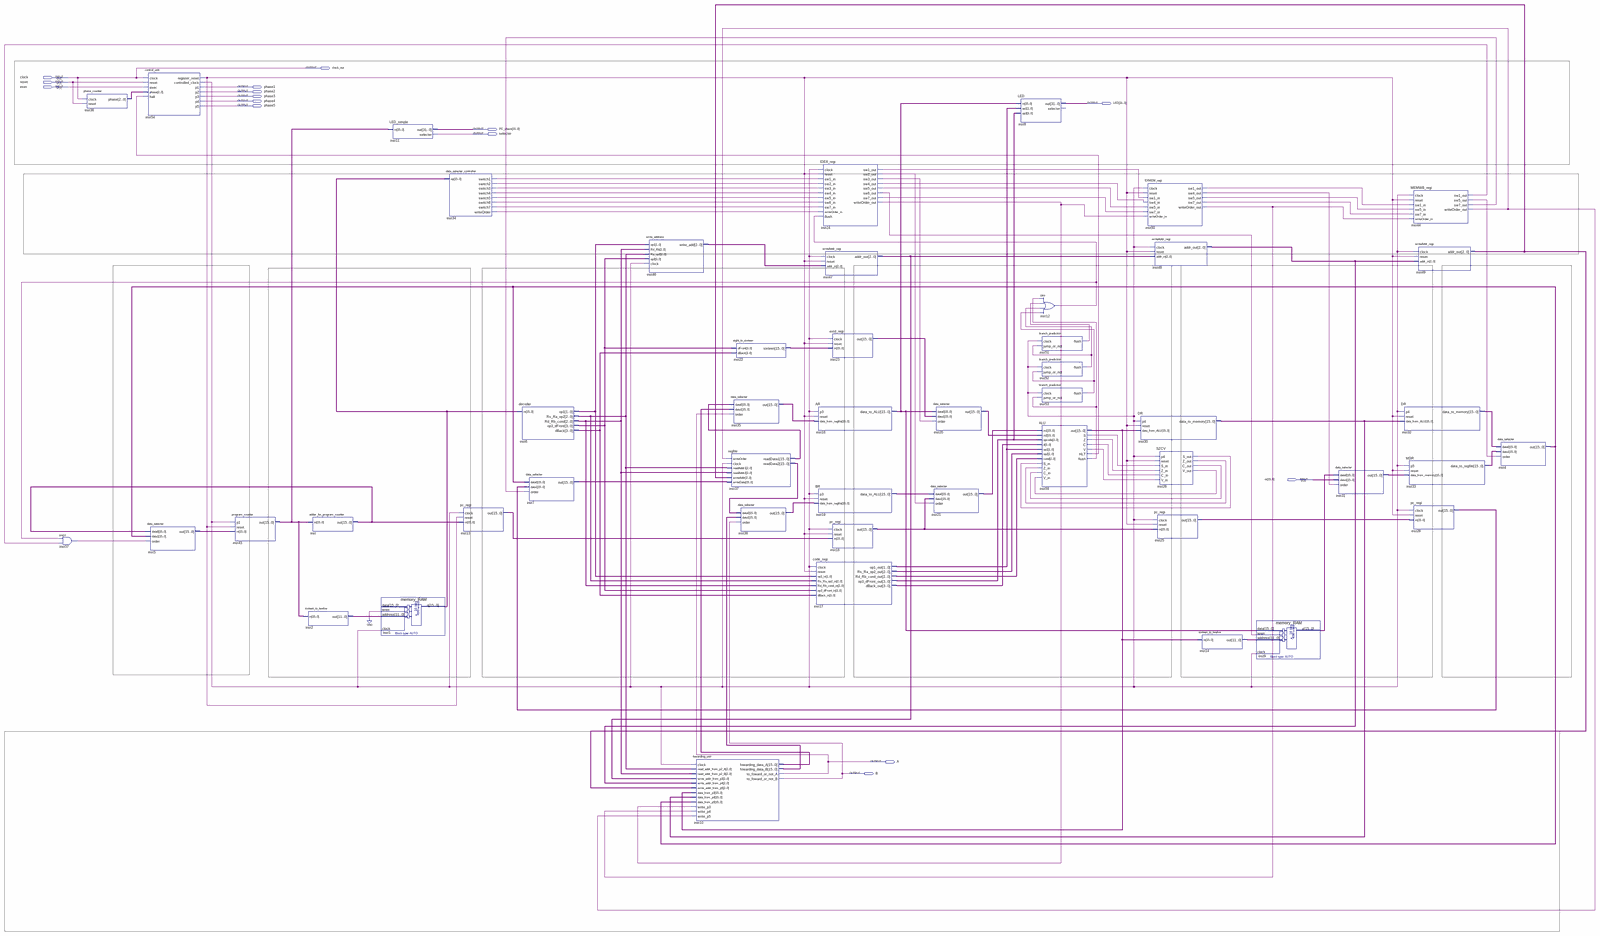
[diagram p0: schematic sheet, whole]
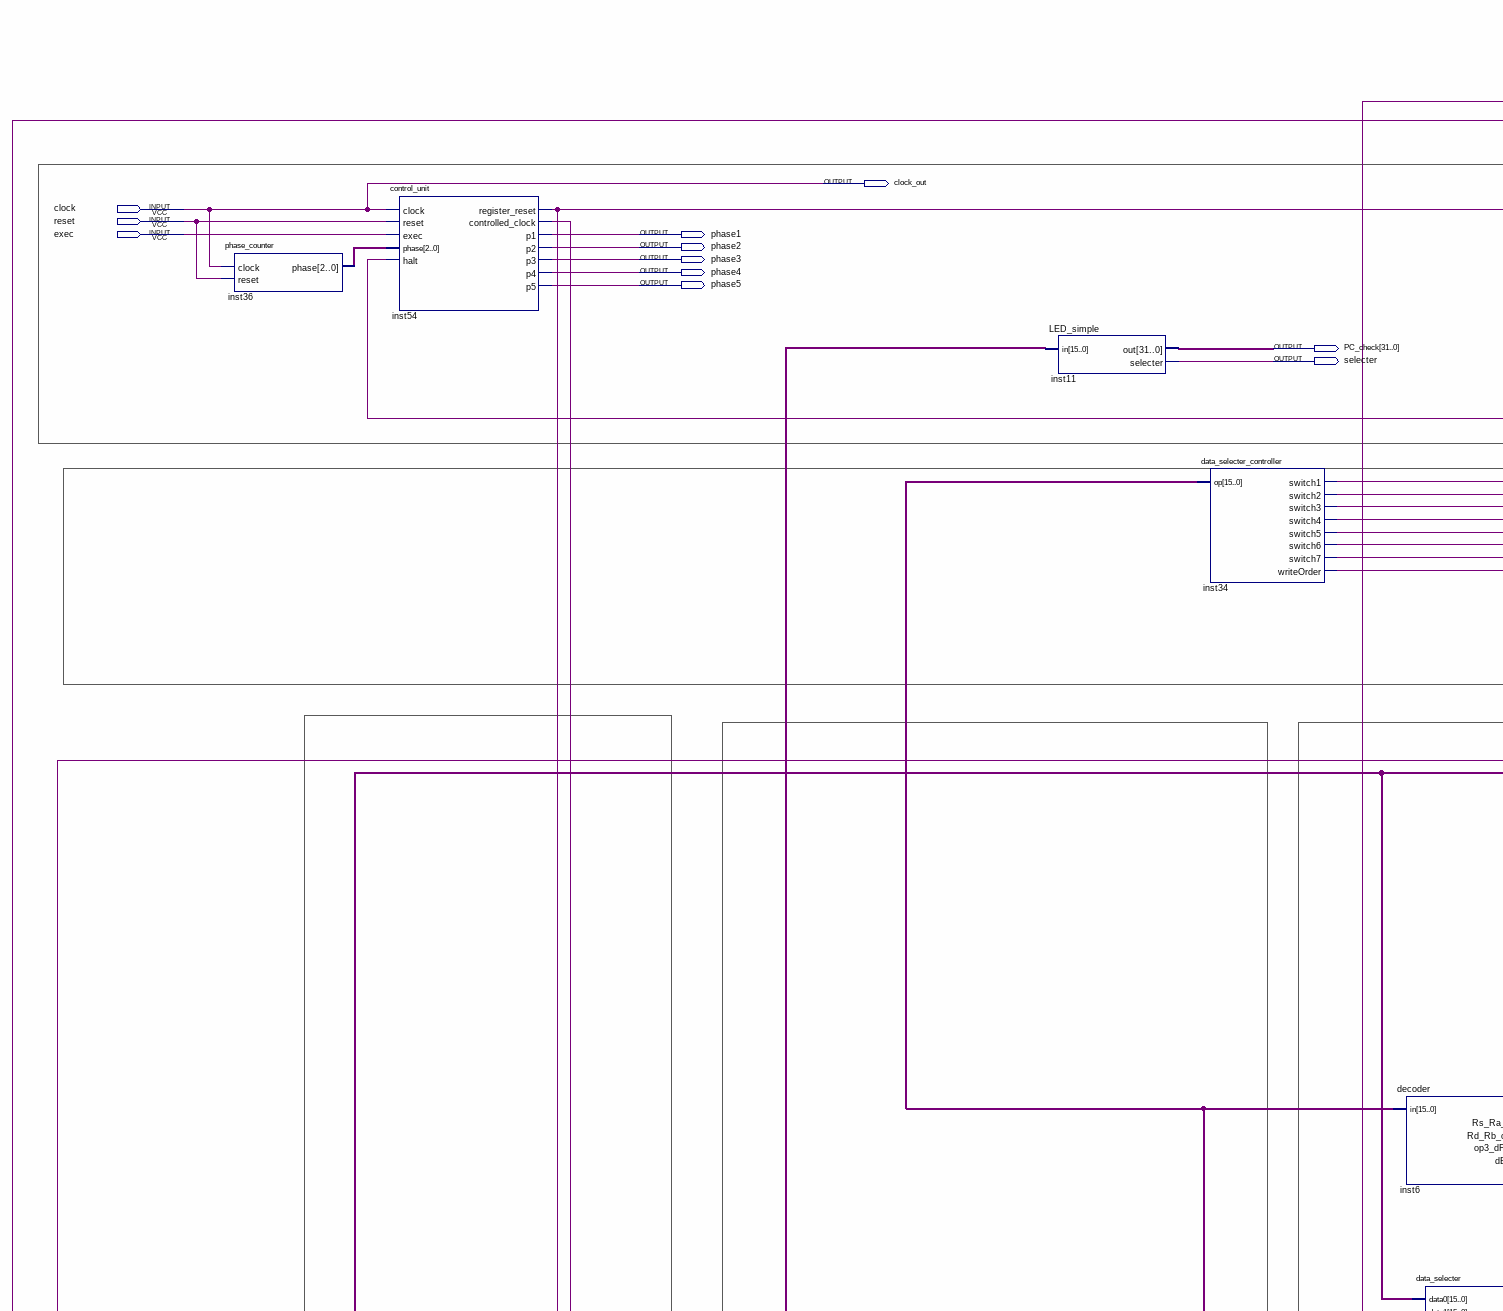
[diagram p1: schematic sheet, upper left part]
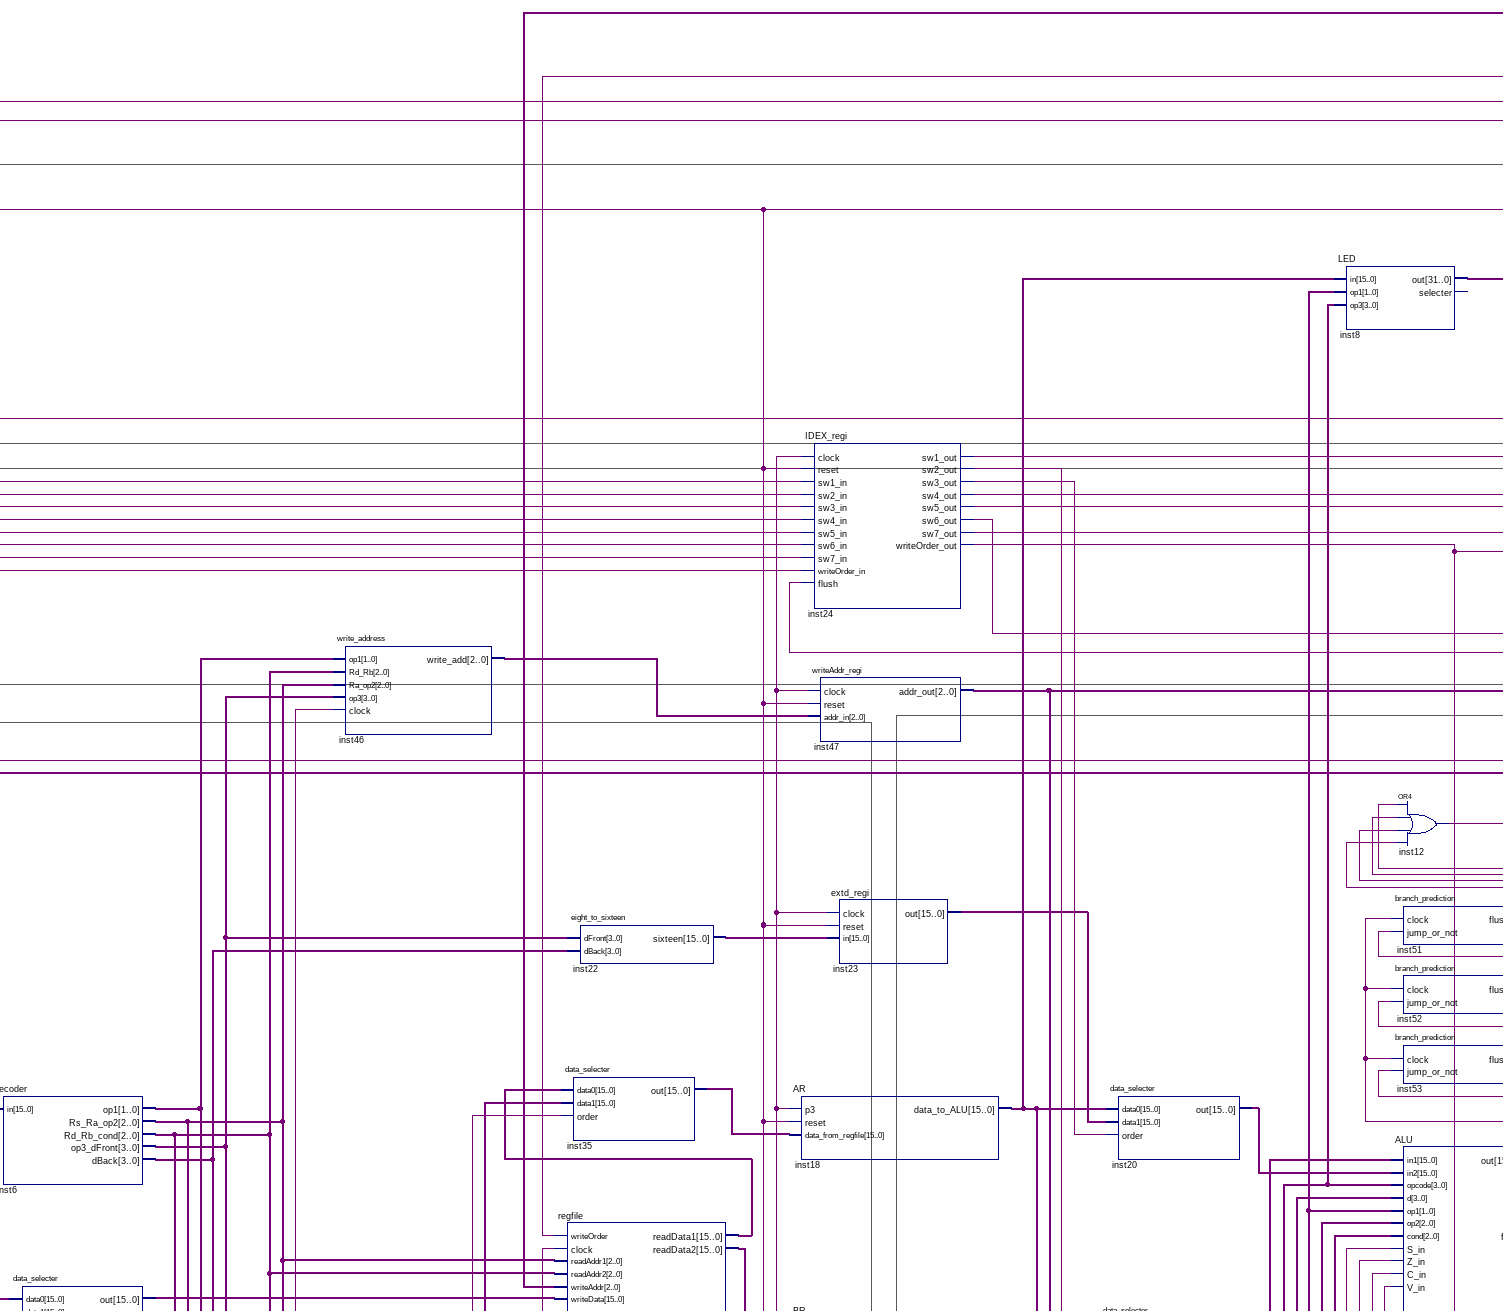
[diagram p2: schematic sheet, upper centre part]
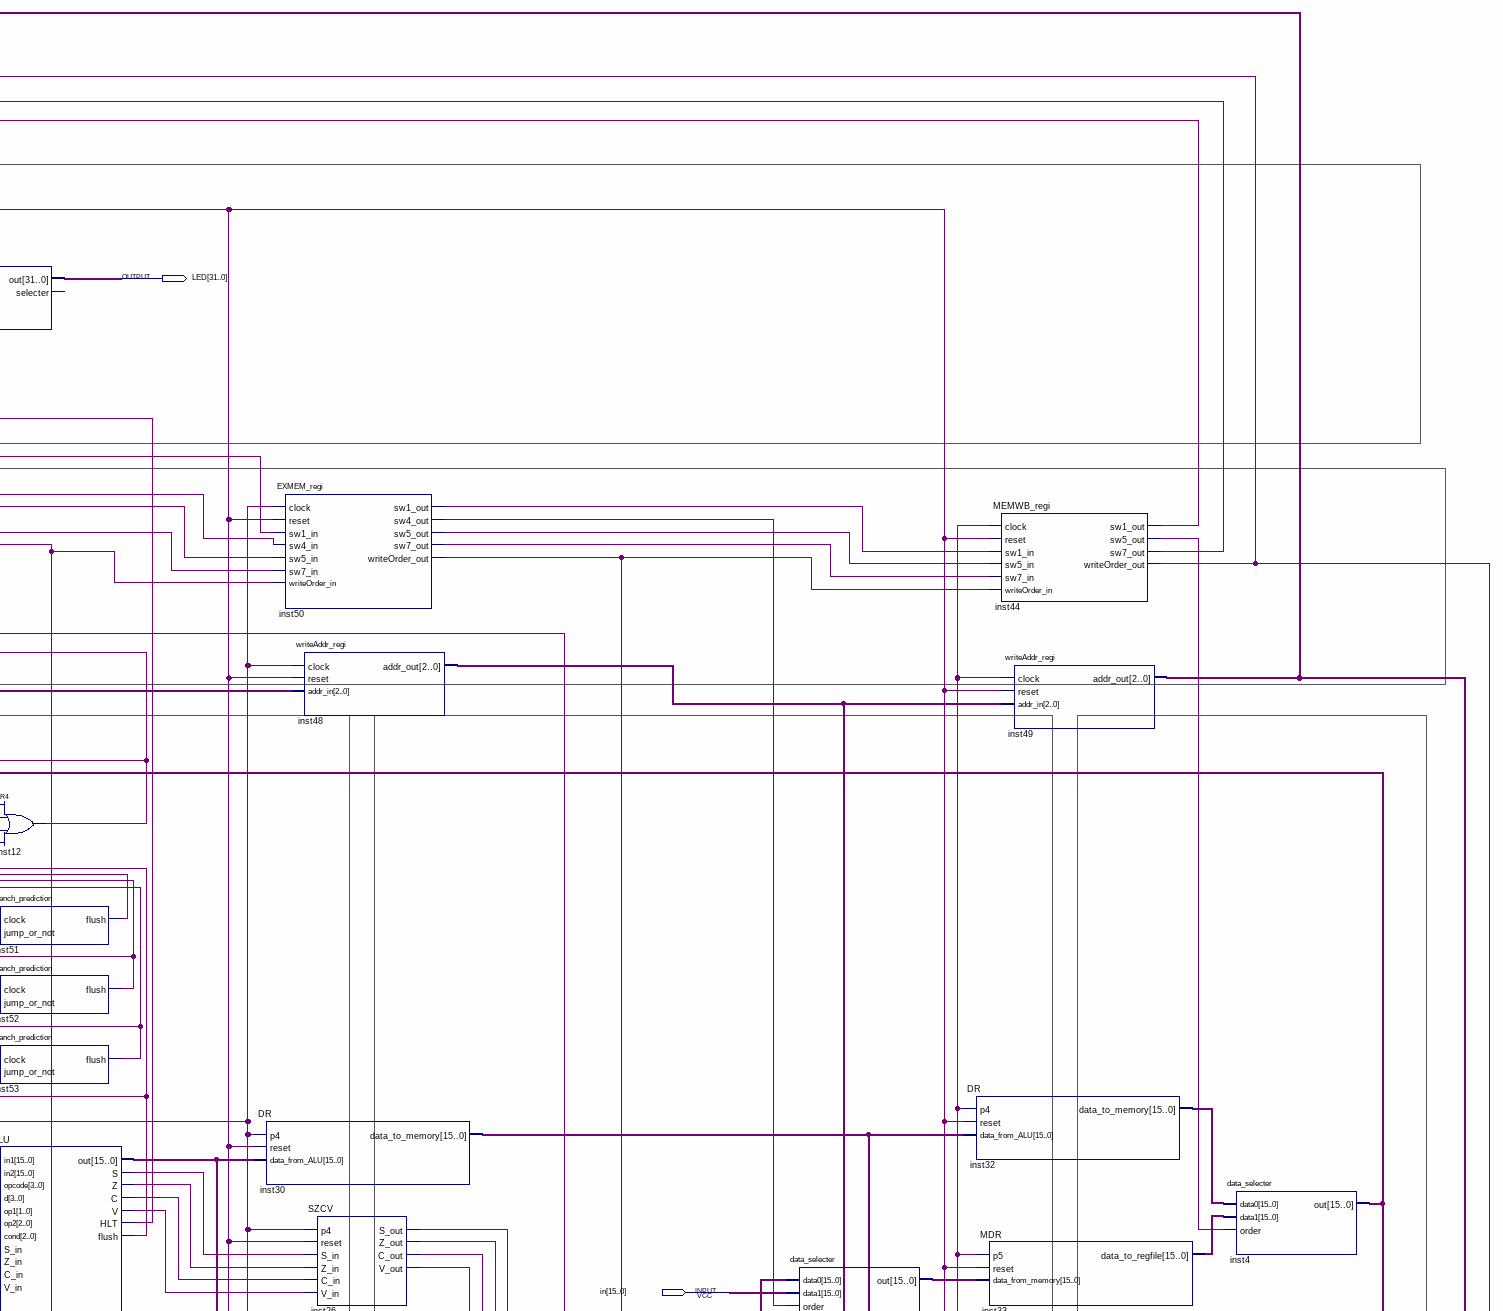
[diagram p3: schematic sheet, upper right part]
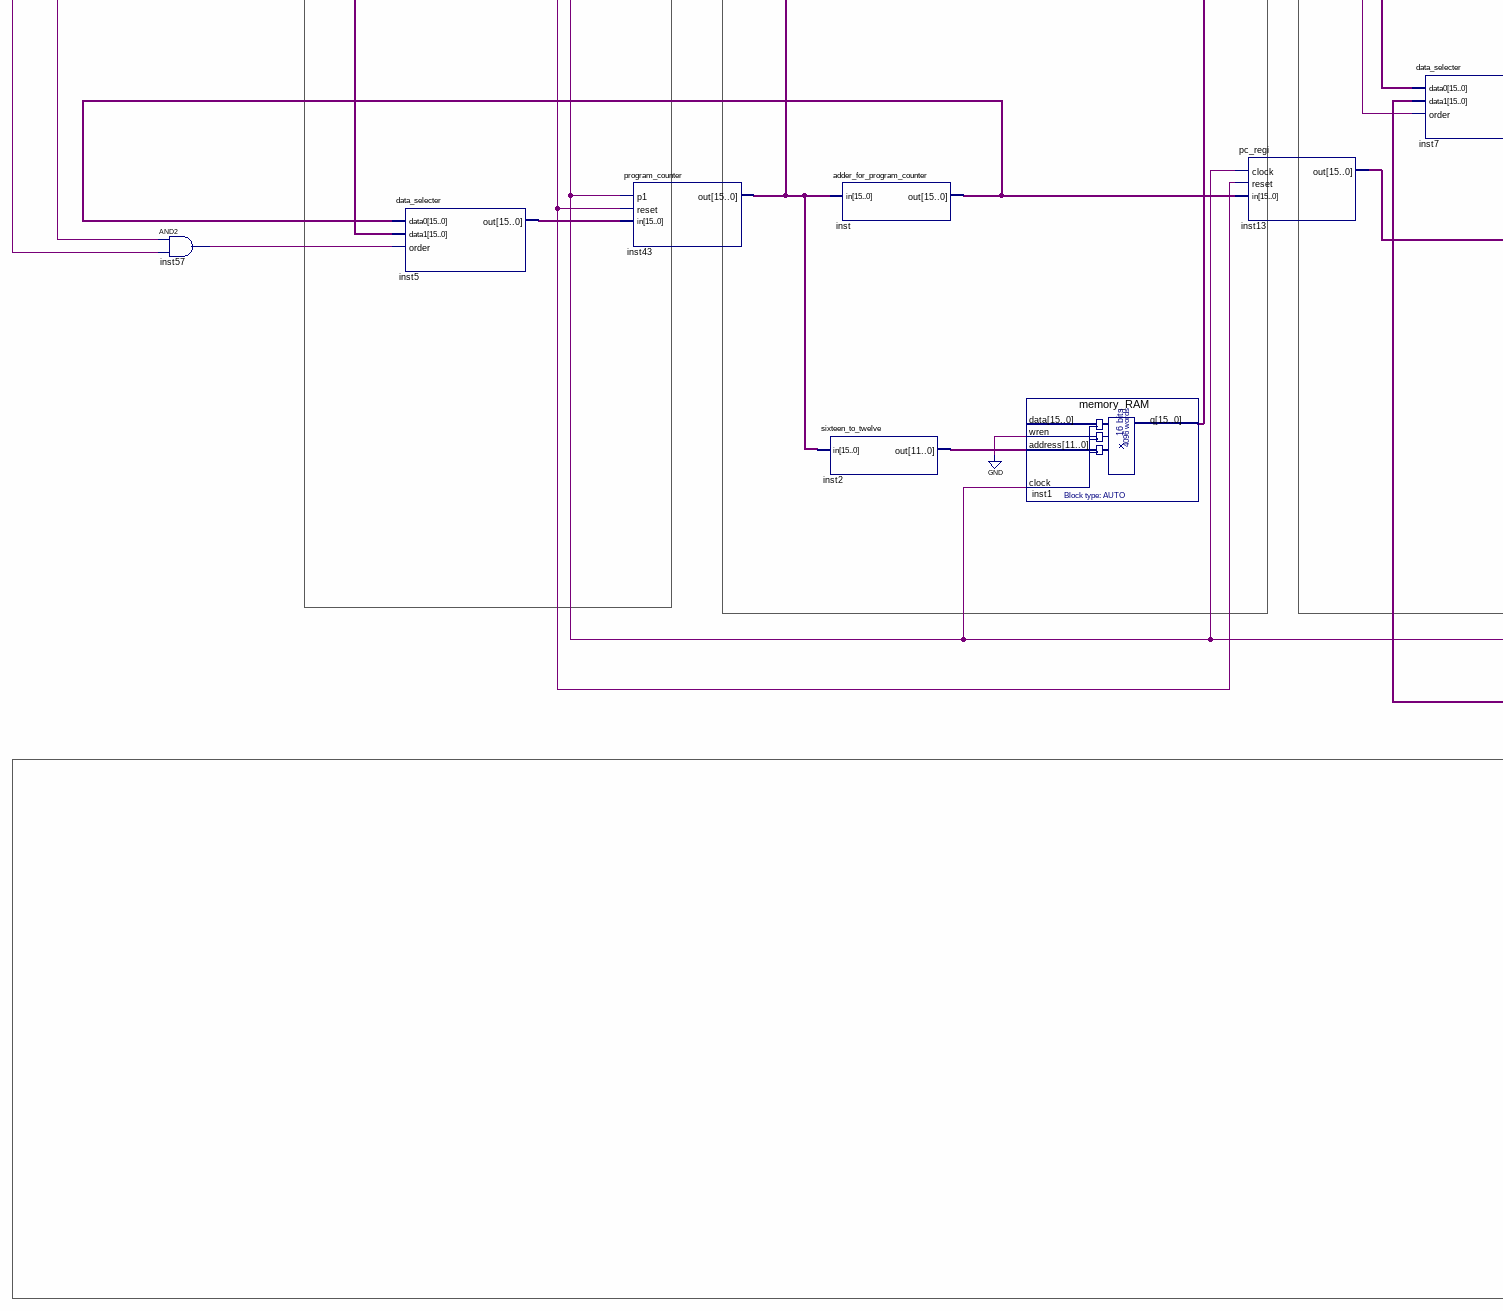
[diagram p4: schematic sheet, lower left part]
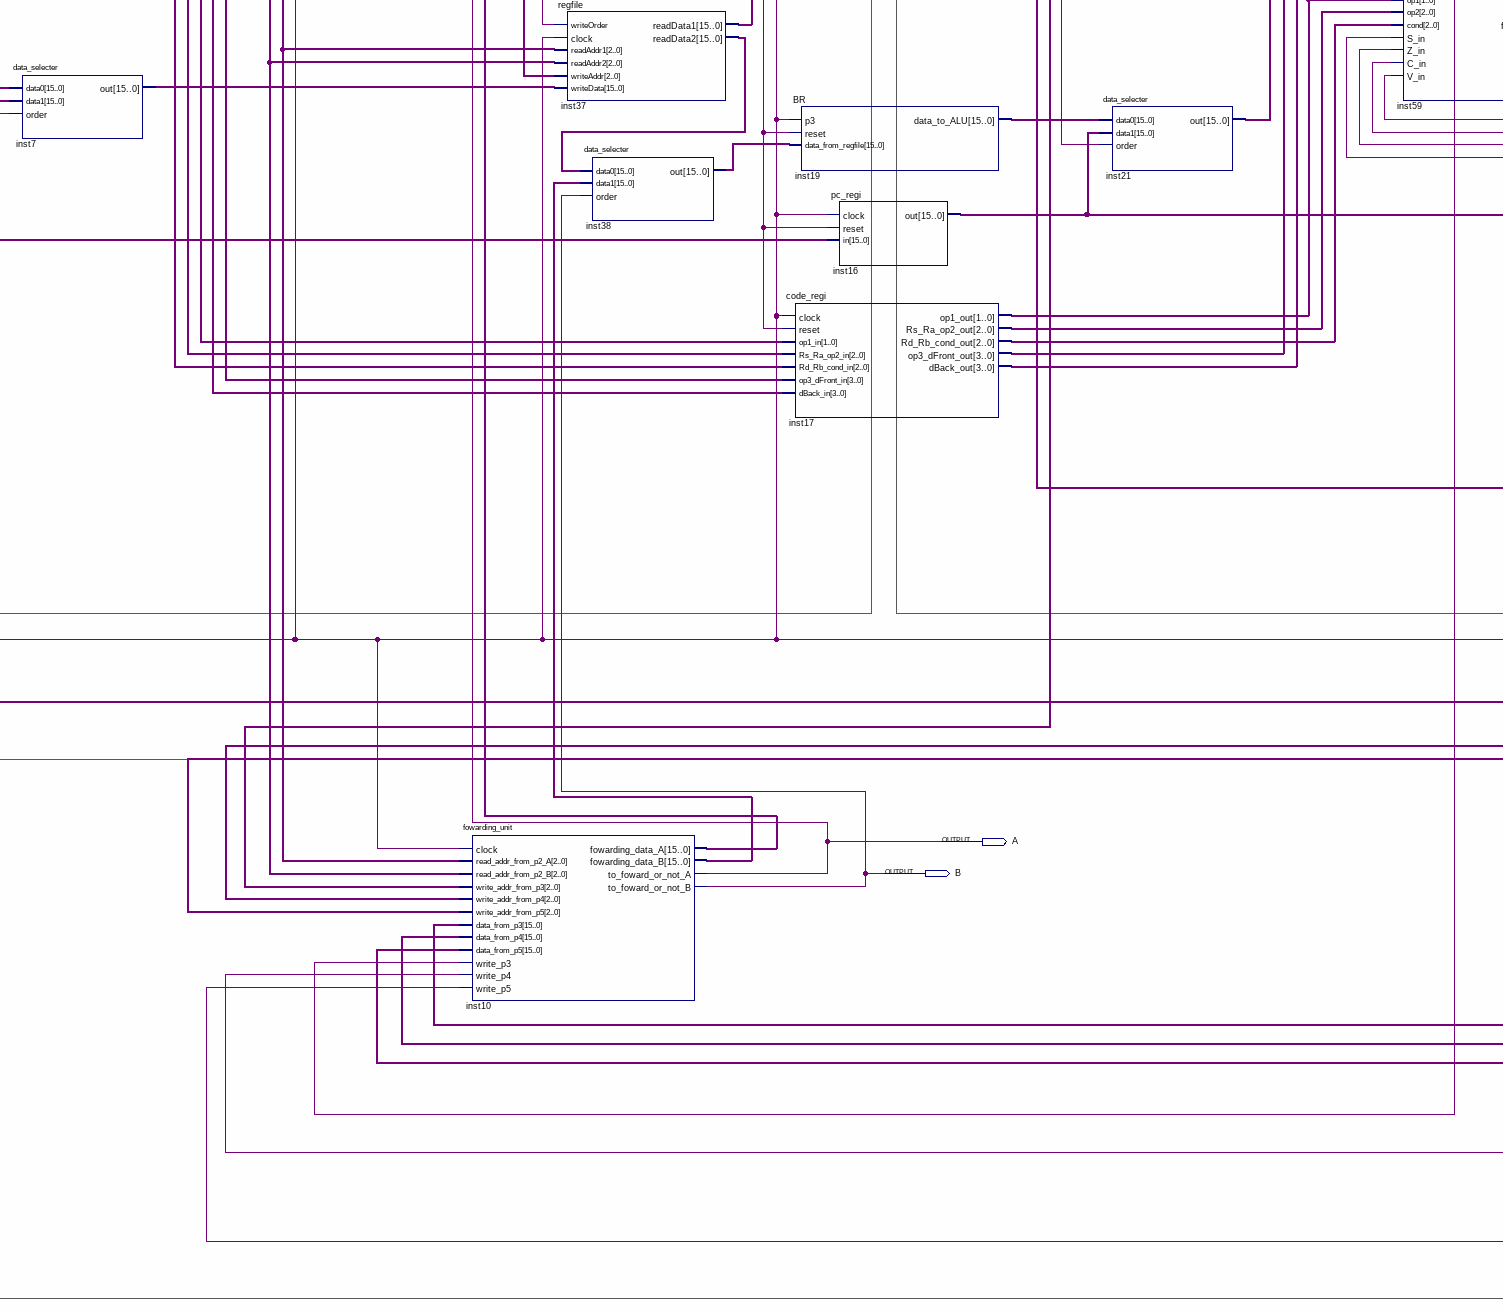
[diagram p5: schematic sheet, lower centre part]
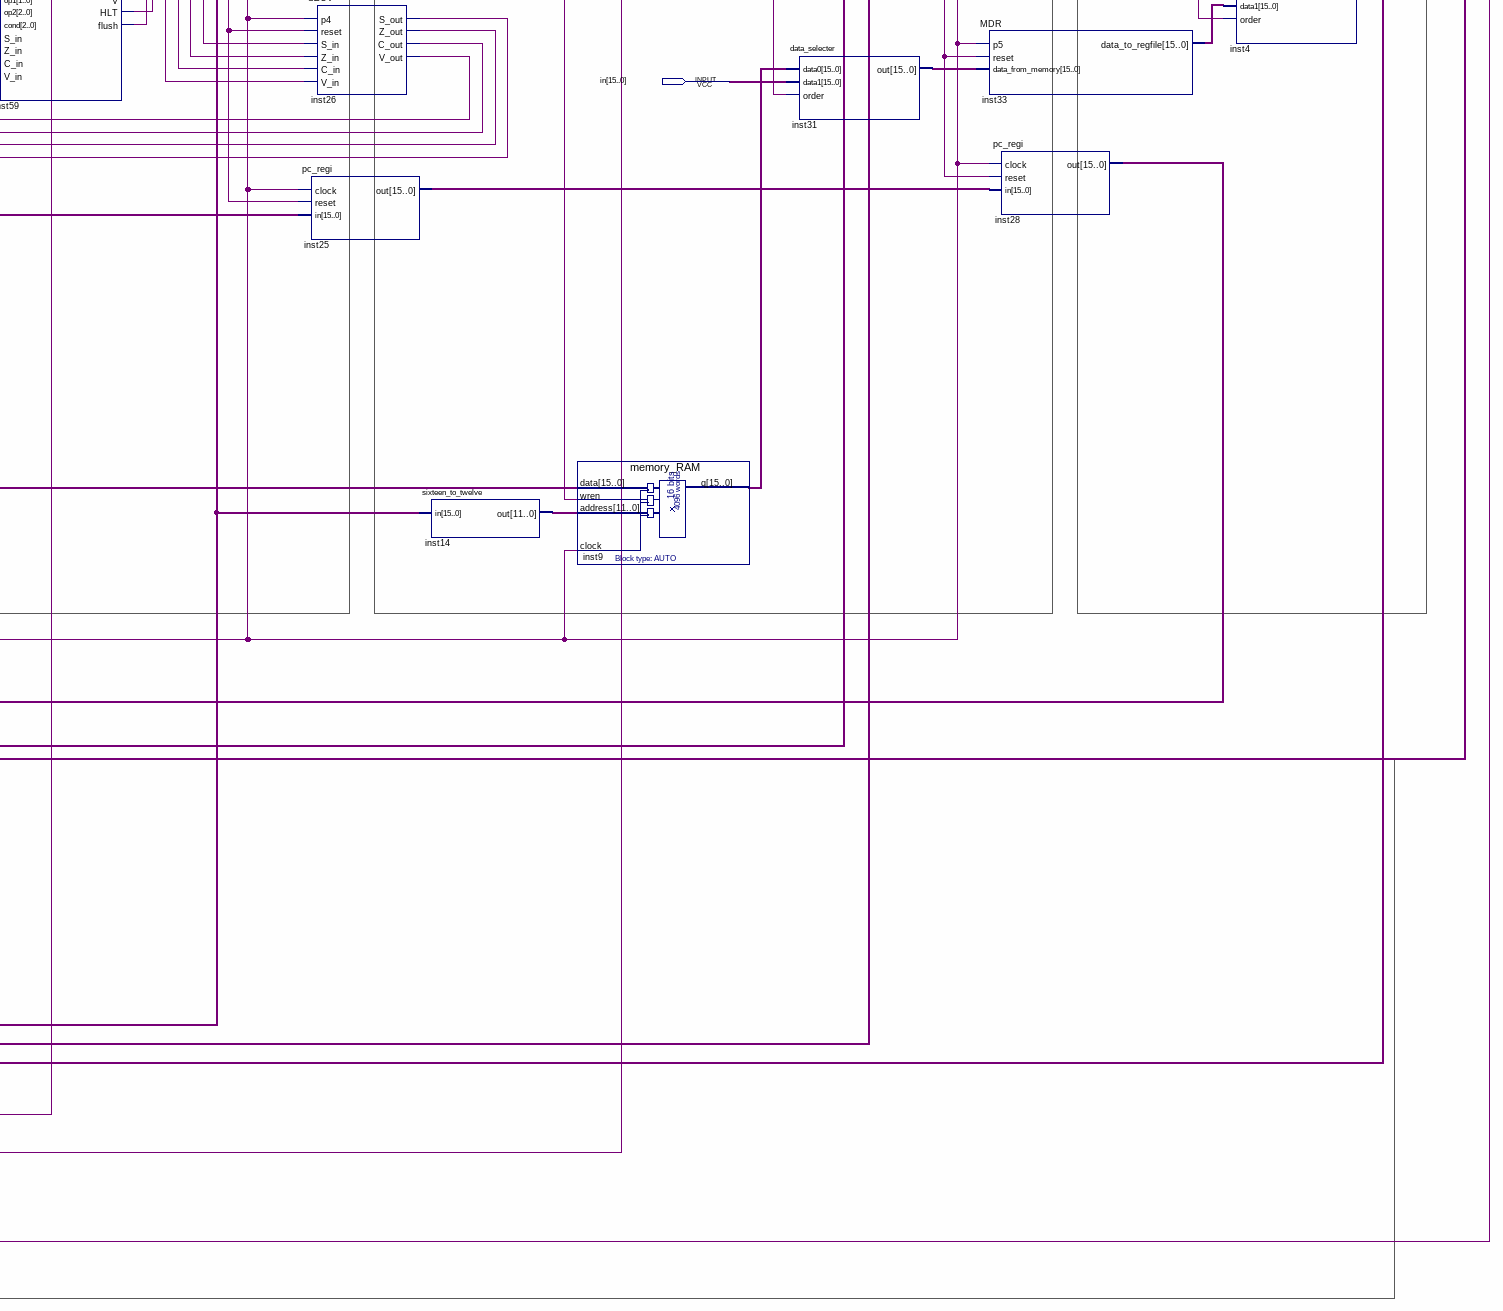
[diagram p6: schematic sheet, lower right part]
// Quartus schematic processor_HARAGUCHI.bdf as structural Verilog: 48 symbols, 15 pins
module processor_HARAGUCHI (
  input  clock,
  input  reset,
  input  exec,
  input  [15:0] in,
  output clock_out,
  output phase1,
  output phase2,
  output phase3,
  output phase4,
  output [31:0] LED,
  output phase5,
  output [31:0] PC_check,
  output selecter,
  output A,
  output B
);

  wire inst12_out, inst24_sw1_out, inst24_sw2_out, inst24_sw3_out, inst24_sw4_out, inst24_sw5_out,
       inst24_sw6_out, inst24_sw7_out, inst24_writeorder_out, inst26_c_out, inst26_s_out, inst26_v_out,
       inst26_z_out, inst34_switch1, inst34_switch2, inst34_switch3, inst34_switch4, inst34_switch5,
       inst34_switch6, inst34_switch7, inst34_writeorder, inst44_sw1_out, inst44_sw5_out, inst44_sw7_out,
       inst44_writeorder_out, inst50_sw1_out, inst50_sw4_out, inst50_sw5_out, inst50_sw7_out,
       inst50_writeorder_out, inst51_flush, inst52_flush, inst53_flush, inst54_controlled_clock,
       inst54_register_reset, inst57_out, inst59_c, inst59_flush, inst59_hlt, inst59_s, inst59_v, inst59_z;
  wire [1:0] inst6_op1, inst17_op1_out;
  wire [2:0] inst6_rd_rb_cond, inst6_rs_ra_op2, inst17_rd_rb_cond_out, inst17_rs_ra_op2_out, inst36_phase,
       inst46_write_add, inst47_addr_out, inst48_addr_out, inst49_addr_out;
  wire [3:0] inst6_dback, inst6_op3_dfront, inst17_dback_out, inst17_op3_dfront_out;
  wire [11:0] inst2_out, inst14_out;
  wire [15:0] inst1_q, inst4_out, inst5_out, inst7_out, inst9_q, inst10_fowarding_data_a,
       inst10_fowarding_data_b, inst13_out, inst16_out, inst18_data_to_alu, inst19_data_to_alu, inst20_out,
       inst21_out, inst22_sixteen, inst23_out, inst25_out, inst28_out, inst30_data_to_memory, inst31_out,
       inst32_data_to_memory, inst33_data_to_regfile, inst35_out, inst37_readdata1, inst37_readdata2,
       inst38_out, inst43_out, inst59_out, inst_out;

  and inst57 (inst57_out, inst12_out, inst44_sw1_out);
  phase_counter inst36 (.clock(clock), .reset(reset), .phase(inst36_phase));
  control_unit inst54 (
    .clock(clock), .reset(reset), .exec(exec), .phase(inst36_phase), .halt(inst59_hlt),
    .register_reset(inst54_register_reset), .controlled_clock(inst54_controlled_clock), .p1(phase1),
    .p2(phase2), .p3(phase3), .p4(phase4), .p5(phase5));
  data_selecter inst5 (.data0(inst_out), .data1(inst4_out), .order(inst57_out), .out(inst5_out));
  program_counter inst43 (
    .p1(inst54_controlled_clock), .reset(inst54_register_reset), .in(inst5_out), .out(inst43_out));
  sixteen_to_twelve inst2 (.in(inst43_out), .out(inst2_out));
  adder_for_program_counter inst (.in(inst43_out), .out(inst_out));
  LED_simple inst11 (.in(inst43_out), .out(PC_check), .selecter(selecter));
  memory_RAM inst1 (.wren(1'b0), .address(inst2_out), .clock(inst54_controlled_clock), .q(inst1_q));  // open: data
  data_selecter_controller inst34 (
    .op(inst1_q), .switch1(inst34_switch1), .switch2(inst34_switch2), .switch3(inst34_switch3),
    .switch4(inst34_switch4), .switch5(inst34_switch5), .switch6(inst34_switch6), .switch7(inst34_switch7),
    .writeOrder(inst34_writeorder));
  pc_regi inst13 (.clock(inst54_controlled_clock), .reset(inst54_register_reset), .in(inst_out), .out(inst13_out));
  decoder inst6 (
    .in(inst1_q), .op1(inst6_op1), .Rs_Ra_op2(inst6_rs_ra_op2), .Rd_Rb_cond(inst6_rd_rb_cond),
    .op3_dFront(inst6_op3_dfront), .dBack(inst6_dback));
  data_selecter inst7 (.data0(inst4_out), .data1(inst28_out), .order(inst44_sw7_out), .out(inst7_out));
  write_address inst46 (
    .op1(inst6_op1), .Rd_Rb(inst6_rd_rb_cond), .Ra_op2(inst6_rs_ra_op2), .op3(inst6_op3_dfront),
    .clock(inst54_controlled_clock), .write_add(inst46_write_add));
  fowarding_unit inst10 (
    .clock(inst54_controlled_clock), .read_addr_from_p2_A(inst6_rs_ra_op2),
    .read_addr_from_p2_B(inst6_rd_rb_cond), .write_addr_from_p3(inst47_addr_out),
    .write_addr_from_p4(inst48_addr_out), .write_addr_from_p5(inst49_addr_out), .data_from_p3(inst59_out),
    .data_from_p4(inst30_data_to_memory), .data_from_p5(inst4_out), .write_p3(inst24_writeorder_out),
    .write_p4(inst50_writeorder_out), .write_p5(inst44_writeorder_out),
    .fowarding_data_A(inst10_fowarding_data_a), .fowarding_data_B(inst10_fowarding_data_b),
    .to_foward_or_not_A(A), .to_foward_or_not_B(B));
  eight_to_sixteen inst22 (.dFront(inst6_op3_dfront), .dBack(inst6_dback), .sixteen(inst22_sixteen));
  data_selecter inst35 (.data0(inst37_readdata1), .data1(inst10_fowarding_data_a), .order(A), .out(inst35_out));
  regfile inst37 (
    .writeOrder(inst44_writeorder_out), .clock(inst54_controlled_clock), .readAddr1(inst6_rs_ra_op2),
    .readAddr2(inst6_rd_rb_cond), .writeAddr(inst49_addr_out), .writeData(inst7_out),
    .readData1(inst37_readdata1), .readData2(inst37_readdata2));
  data_selecter inst38 (.data0(inst37_readdata2), .data1(inst10_fowarding_data_b), .order(B), .out(inst38_out));
  code_regi inst17 (
    .clock(inst54_controlled_clock), .reset(inst54_register_reset), .op1_in(inst6_op1),
    .Rs_Ra_op2_in(inst6_rs_ra_op2), .Rd_Rb_cond_in(inst6_rd_rb_cond), .op3_dFront_in(inst6_op3_dfront),
    .dBack_in(inst6_dback), .op1_out(inst17_op1_out), .Rs_Ra_op2_out(inst17_rs_ra_op2_out),
    .Rd_Rb_cond_out(inst17_rd_rb_cond_out), .op3_dFront_out(inst17_op3_dfront_out),
    .dBack_out(inst17_dback_out));
  IDEX_regi inst24 (
    .clock(inst54_controlled_clock), .reset(inst54_register_reset), .sw1_in(inst34_switch1),
    .sw2_in(inst34_switch2), .sw3_in(inst34_switch3), .sw4_in(inst34_switch4), .sw5_in(inst34_switch5),
    .sw6_in(inst34_switch6), .sw7_in(inst34_switch7), .writeOrder_in(inst34_writeorder), .flush(inst12_out),
    .sw1_out(inst24_sw1_out), .sw2_out(inst24_sw2_out), .sw3_out(inst24_sw3_out), .sw4_out(inst24_sw4_out),
    .sw5_out(inst24_sw5_out), .sw6_out(inst24_sw6_out), .sw7_out(inst24_sw7_out),
    .writeOrder_out(inst24_writeorder_out));
  writeAddr_regi inst47 (
    .clock(inst54_controlled_clock), .reset(inst54_register_reset), .addr_in(inst46_write_add),
    .addr_out(inst47_addr_out));
  extd_regi inst23 (
    .clock(inst54_controlled_clock), .reset(inst54_register_reset), .in(inst22_sixteen), .out(inst23_out));
  AR inst18 (
    .p3(inst54_controlled_clock), .reset(inst54_register_reset), .data_from_regfile(inst35_out),
    .data_to_ALU(inst18_data_to_alu));
  BR inst19 (
    .p3(inst54_controlled_clock), .reset(inst54_register_reset), .data_from_regfile(inst38_out),
    .data_to_ALU(inst19_data_to_alu));
  pc_regi inst16 (.clock(inst54_controlled_clock), .reset(inst54_register_reset), .in(inst13_out), .out(inst16_out));
  data_selecter inst20 (.data0(inst18_data_to_alu), .data1(inst23_out), .order(inst24_sw3_out), .out(inst20_out));
  data_selecter inst21 (.data0(inst19_data_to_alu), .data1(inst16_out), .order(inst24_sw2_out), .out(inst21_out));
  LED inst8 (.in(inst18_data_to_alu), .op1(inst17_op1_out), .op3(inst17_op3_dfront_out), .out(LED));  // open: selecter
  branch_prediction inst51 (.clock(inst54_controlled_clock), .jump_or_not(inst52_flush), .flush(inst51_flush));
  branch_prediction inst52 (.clock(inst54_controlled_clock), .jump_or_not(inst53_flush), .flush(inst52_flush));
  branch_prediction inst53 (.clock(inst54_controlled_clock), .jump_or_not(inst59_flush), .flush(inst53_flush));
  ALU inst59 (
    .in1(inst21_out), .in2(inst20_out), .opcode(inst17_op3_dfront_out), .d(inst17_dback_out),
    .op1(inst17_op1_out), .op2(inst17_rs_ra_op2_out), .cond(inst17_rd_rb_cond_out), .S_in(inst26_s_out),
    .Z_in(inst26_z_out), .C_in(inst26_c_out), .V_in(inst26_v_out), .out(inst59_out), .S(inst59_s),
    .Z(inst59_z), .C(inst59_c), .V(inst59_v), .HLT(inst59_hlt), .flush(inst59_flush));
  or inst12 (inst12_out, inst59_flush, inst51_flush, inst52_flush, inst53_flush);
  EXMEM_regi inst50 (
    .clock(inst54_controlled_clock), .reset(inst54_register_reset), .sw1_in(inst24_sw1_out),
    .sw4_in(inst24_sw4_out), .sw5_in(inst24_sw5_out), .sw7_in(inst24_sw7_out),
    .writeOrder_in(inst24_writeorder_out), .sw1_out(inst50_sw1_out), .sw4_out(inst50_sw4_out),
    .sw5_out(inst50_sw5_out), .sw7_out(inst50_sw7_out), .writeOrder_out(inst50_writeorder_out));
  writeAddr_regi inst48 (
    .clock(inst54_controlled_clock), .reset(inst54_register_reset), .addr_in(inst47_addr_out),
    .addr_out(inst48_addr_out));
  DR inst30 (
    .p4(inst54_controlled_clock), .reset(inst54_register_reset), .data_from_ALU(inst59_out),
    .data_to_memory(inst30_data_to_memory));
  SZCV inst26 (
    .p4(inst54_controlled_clock), .reset(inst54_register_reset), .S_in(inst59_s), .Z_in(inst59_z),
    .C_in(inst59_c), .V_in(inst59_v), .S_out(inst26_s_out), .Z_out(inst26_z_out), .C_out(inst26_c_out),
    .V_out(inst26_v_out));
  pc_regi inst25 (.clock(inst54_controlled_clock), .reset(inst54_register_reset), .in(inst16_out), .out(inst25_out));
  sixteen_to_twelve inst14 (.in(inst59_out), .out(inst14_out));
  memory_RAM inst9 (
    .data(inst18_data_to_alu), .wren(inst24_sw6_out), .address(inst14_out), .clock(inst54_controlled_clock),
    .q(inst9_q));
  data_selecter inst31 (.data0(inst9_q), .data1(in), .order(inst50_sw4_out), .out(inst31_out));
  MEMWB_regi inst44 (
    .clock(inst54_controlled_clock), .reset(inst54_register_reset), .sw1_in(inst50_sw1_out),
    .sw5_in(inst50_sw5_out), .sw7_in(inst50_sw7_out), .writeOrder_in(inst50_writeorder_out),
    .sw1_out(inst44_sw1_out), .sw5_out(inst44_sw5_out), .sw7_out(inst44_sw7_out),
    .writeOrder_out(inst44_writeorder_out));
  writeAddr_regi inst49 (
    .clock(inst54_controlled_clock), .reset(inst54_register_reset), .addr_in(inst48_addr_out),
    .addr_out(inst49_addr_out));
  DR inst32 (
    .p4(inst54_controlled_clock), .reset(inst54_register_reset), .data_from_ALU(inst30_data_to_memory),
    .data_to_memory(inst32_data_to_memory));
  MDR inst33 (
    .p5(inst54_controlled_clock), .reset(inst54_register_reset), .data_from_memory(inst31_out),
    .data_to_regfile(inst33_data_to_regfile));
  pc_regi inst28 (.clock(inst54_controlled_clock), .reset(inst54_register_reset), .in(inst25_out), .out(inst28_out));
  data_selecter inst4 (
    .data0(inst32_data_to_memory), .data1(inst33_data_to_regfile), .order(inst44_sw5_out), .out(inst4_out));

  assign clock_out = clock;
endmodule
